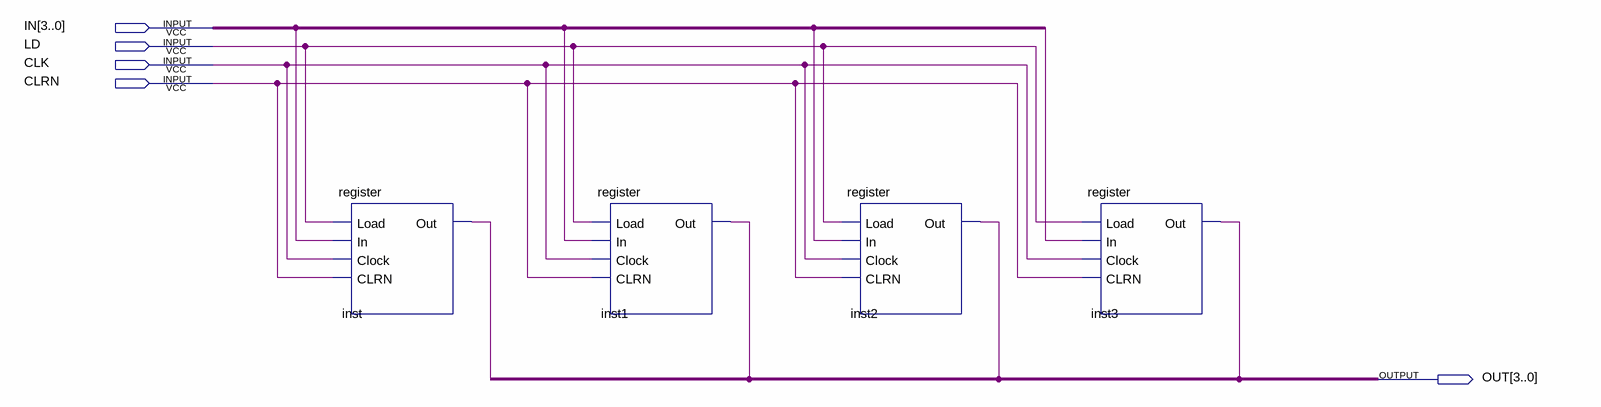
[diagram p0: schematic sheet]
// Quartus schematic reg4b.bdf as structural Verilog: 4 symbols, 5 pins
module reg4b (
  input  [3:0] IN,
  input  LD,
  input  CLK,
  input  CLRN,
  output [3:0] OUT
);

  wire inst1_out, inst2_out, inst3_out, inst_out, undriven, undriven_2, undriven_3, undriven_4;

  register inst (.Load(LD), .In(undriven_4), .Clock(CLK), .CLRN(CLRN), .Out(inst_out));
  register inst1 (.Load(LD), .In(undriven_2), .Clock(CLK), .CLRN(CLRN), .Out(inst1_out));
  register inst2 (.Load(LD), .In(undriven_3), .Clock(CLK), .CLRN(CLRN), .Out(inst2_out));
  register inst3 (.Load(LD), .In(undriven), .Clock(CLK), .CLRN(CLRN), .Out(inst3_out));
endmodule
